# Altium schematic sheet PIN_HEADER.SchDoc
size A4
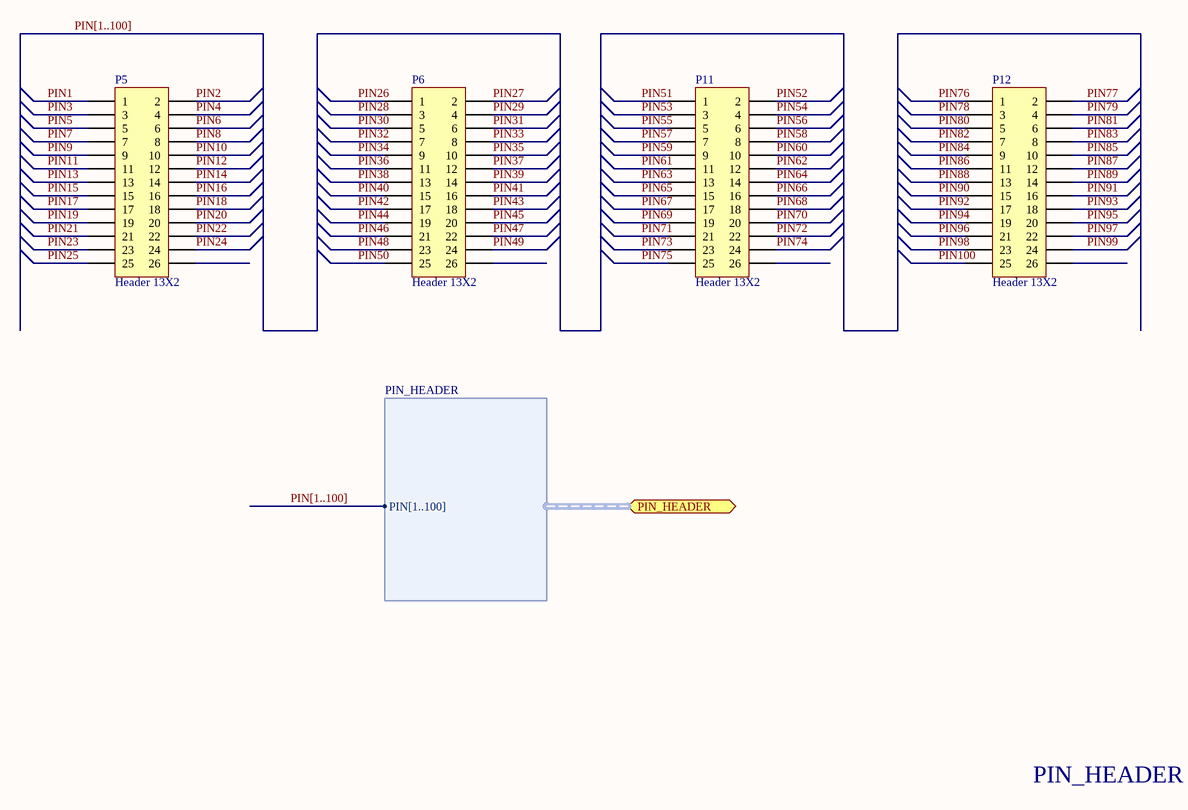
[diagram p0: PIN_HEADER.SchDoc]

## Parts
P5  Header 13X2  [HDR2X13]
P6  Header 13X2  [HDR2X13]
P11  Header 13X2  [HDR2X13]
P12  Header 13X2  [HDR2X13]

## Ports
PIN_HEADER (harness PIN_HEADER)

## Harnesses
PIN_HEADER: PIN[1..100]

## Nets
PIN1: P5.1
PIN2: P5.2
PIN3: P5.3
PIN4: P5.4
PIN5: P5.5
PIN6: P5.6
PIN7: P5.7
PIN8: P5.8
PIN9: P5.9
PIN10: P5.10
PIN11: P5.11
PIN12: P5.12
PIN13: P5.13
PIN14: P5.14
PIN15: P5.15
PIN16: P5.16
PIN17: P5.17
PIN18: P5.18
PIN19: P5.19
PIN20: P5.20
PIN21: P5.21
PIN22: P5.22
PIN23: P5.23
PIN24: P5.24
PIN25: P5.25
PIN26: P6.1
PIN27: P6.2
PIN28: P6.3
PIN29: P6.4
PIN30: P6.5
PIN31: P6.6
PIN32: P6.7
PIN33: P6.8
PIN34: P6.9
PIN35: P6.10
PIN36: P6.11
PIN37: P6.12
PIN38: P6.13
PIN39: P6.14
PIN40: P6.15
PIN41: P6.16
PIN42: P6.17
PIN43: P6.18
PIN44: P6.19
PIN45: P6.20
PIN46: P6.21
PIN47: P6.22
PIN48: P6.23
PIN49: P6.24
PIN50: P6.25
PIN51: P11.1
PIN52: P11.2
PIN53: P11.3
PIN54: P11.4
PIN55: P11.5
PIN56: P11.6
PIN57: P11.7
PIN58: P11.8
PIN59: P11.9
PIN60: P11.10
PIN61: P11.11
PIN62: P11.12
PIN63: P11.13
PIN64: P11.14
PIN65: P11.15
PIN66: P11.16
PIN67: P11.17
PIN68: P11.18
PIN69: P11.19
PIN70: P11.20
PIN71: P11.21
PIN72: P11.22
PIN73: P11.23
PIN74: P11.24
PIN75: P11.25
PIN76: P12.1
PIN77: P12.2
PIN78: P12.3
PIN79: P12.4
PIN80: P12.5
PIN81: P12.6
PIN82: P12.7
PIN83: P12.8
PIN84: P12.9
PIN85: P12.10
PIN86: P12.11
PIN87: P12.12
PIN88: P12.13
PIN89: P12.14
PIN90: P12.15
PIN91: P12.16
PIN92: P12.17
PIN93: P12.18
PIN94: P12.19
PIN95: P12.20
PIN96: P12.21
PIN97: P12.22
PIN98: P12.23
PIN99: P12.24
PIN100: P12.25

Not connected (* = marked no-connect by the designer): P5 26; P6 26; P11 26; P12 26

## Buses and harness runs
bus PIN[1..100]

## Notes on the sheet
- PIN_HEADER

## Library data of the parts
P5 P6 P11 P12 = Header 13X2: Header, 13-Pin, Dual row; LatestRevisionDate: 17-Jul-2002; LatestRevisionNote: Re-released for DXP Platform.; Publisher: Altium Limited